# EAGLE design audiostick (EAGLE 9.4.2)
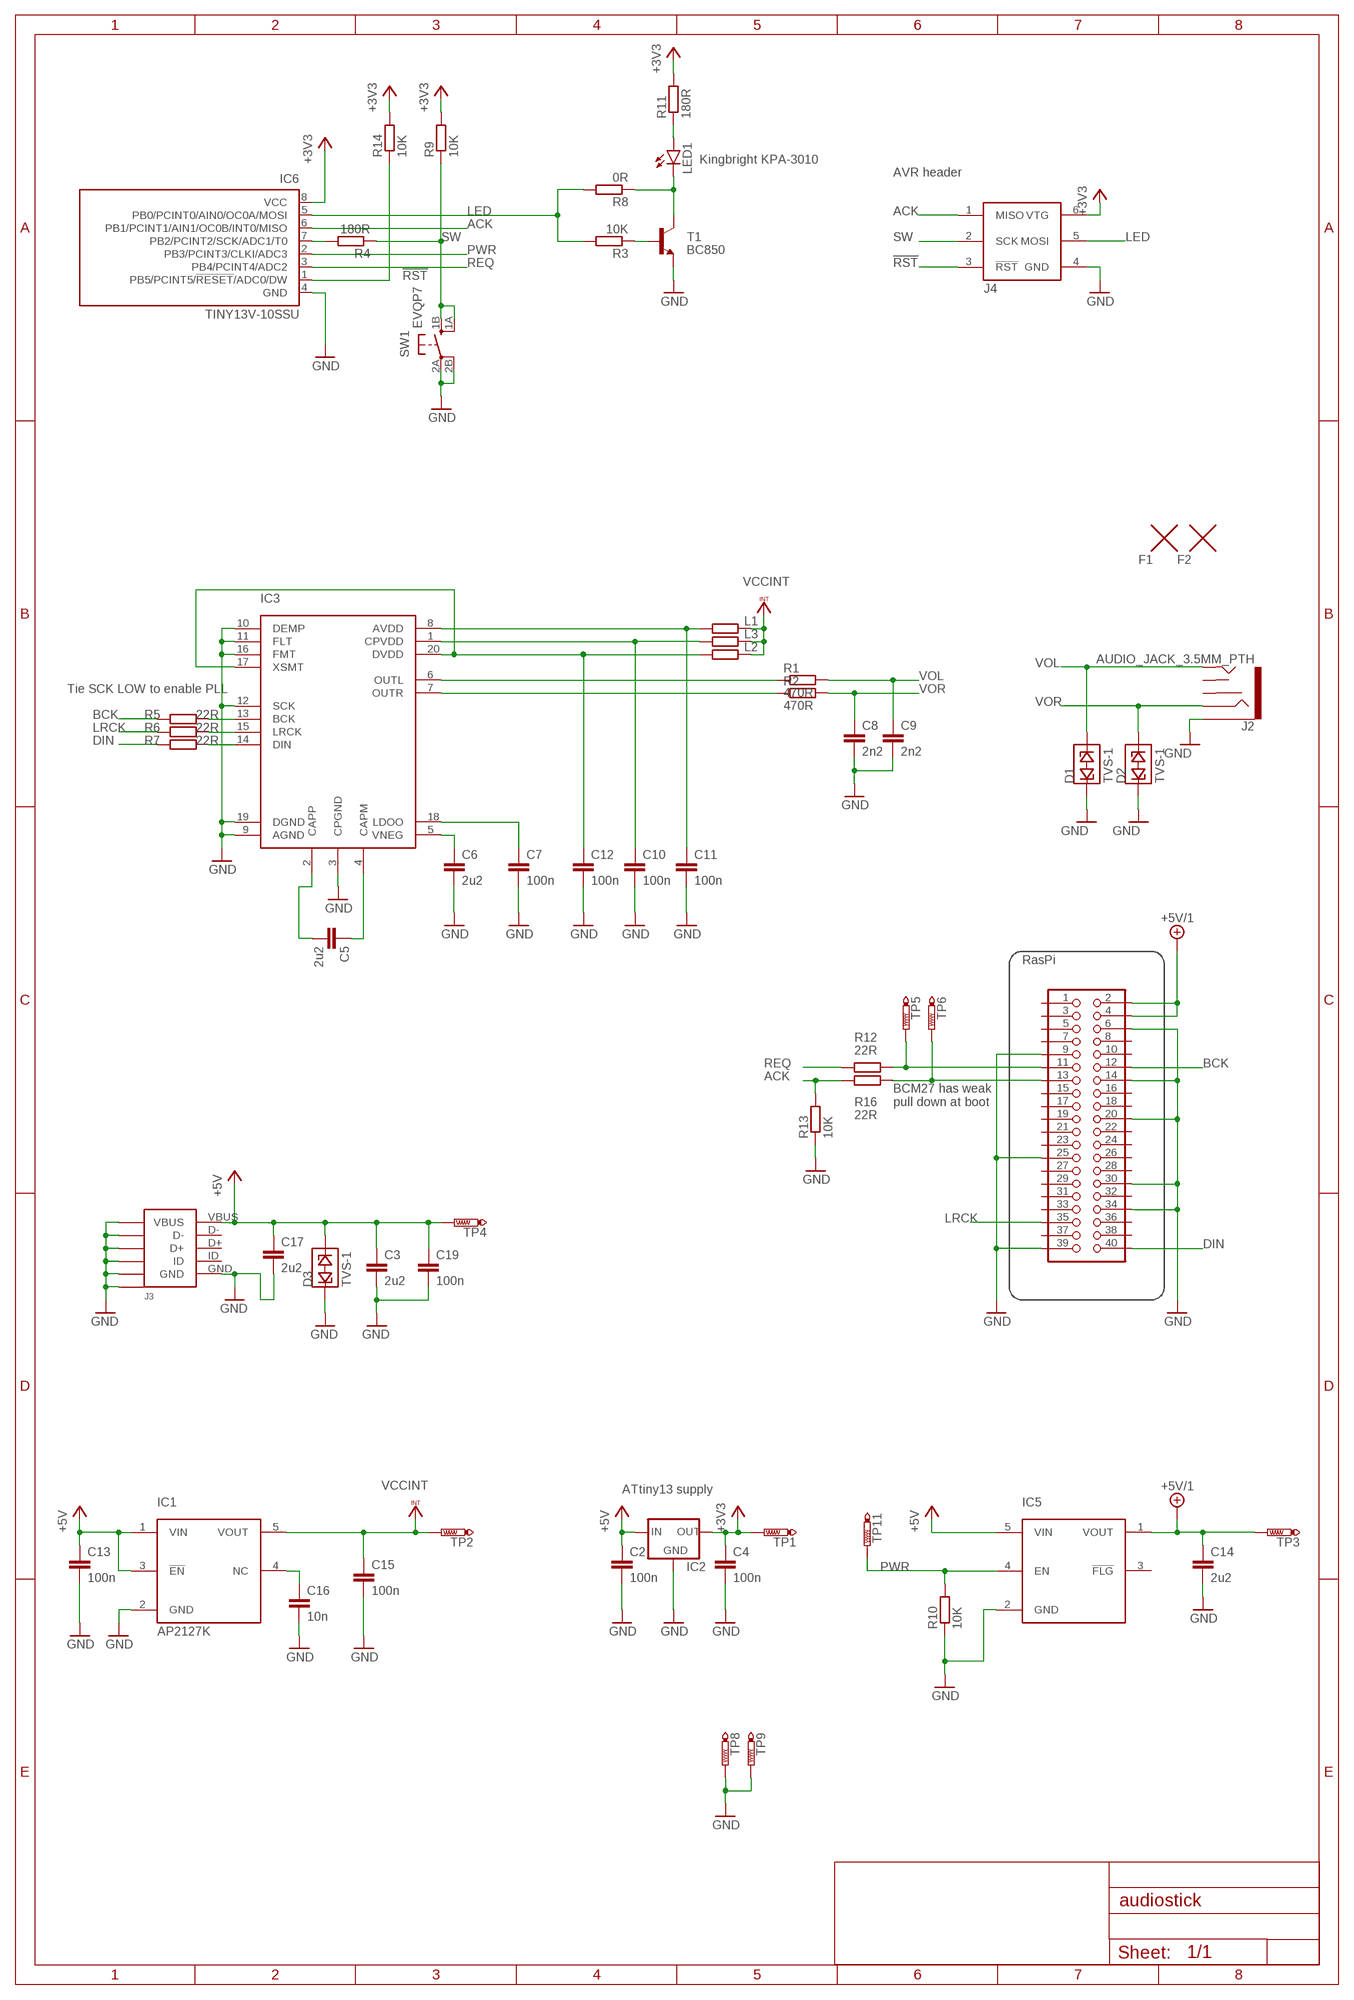
[diagram p0: schematic, sheet 1]

## Parts
C2  100n  C-EUC0603  [C0603]
C3  2u2  C-EUC0603  [C0603]
C4  100n  C-EUC0603  [C0603]
C5  2u2  C-EUC0603  [C0603]
C6  2u2  C-EUC0603  [C0603]
C7  100n  C-EUC0603  [C0603]
C8  2n2  C-EUC0603  [C0603]
C9  2n2  C-EUC0603  [C0603]
C10  100n  C-EUC0603  [C0603]
C11  100n  C-EUC0603  [C0603]
C12  100n  C-EUC0603  [C0603]
C13  100n  C-EUC0603  [C0603]
C14  2u2  C-EUC0603  [C0603]
C15  100n  C-EUC0603  [C0603]
C16  10n  C-EUC0603  [C0603]
C17  2u2  C-EUC0603  [C0603]
C19  100n  C-EUC0603  [C0603]
D1  TVS-1  [R0603]
D2  TVS-1  [R0603]
D3  TVS-1  [R0603]
F1  FIDUCIALC2  [CIRCLE-1MM-3R]
F2  FIDUCIALC2  [CIRCLE-1MM-3R]
IC1  AP2127K  [GHI_SOT23-5]
IC2  MCP1700TT  [SOT-23]
IC3  PCM5102ASW  [TSSOP20]
IC5  AP22804W5  [GHI_SOT23-5]
IC6  TINY13V-10SSU  [8S1]
J2  AUDIO_JACK_3.5MM_PTH  [AUDIO-JACK]
J3  USB-B  [1050170001]
J4  AVRISP  [2X3-1.27]
L1  F  R-EU_R0603  [R0603]
L2  F  R-EU_R0603  [R0603]
L3  F  R-EU_R0603  [R0603]
LED1  LEDLED  [KPA-3010]
R1  470R  R-EU_R0603  [R0603]
R2  470R  R-EU_R0603  [R0603]
R3  10K  R-EU_R0603  [R0603]
R4  180R  R-EU_R0603  [R0603]
R5  22R  R-EU_R0603  [R0603]
R6  22R  R-EU_R0603  [R0603]
R7  22R  R-EU_R0603  [R0603]
R8  0R  R-EU_R0603  [R0603]
R9  10K  R-EU_R0603  [R0603]
R10  10K  R-EU_R0603  [R0603]
R11  180R  R-EU_R0603  [R0603]
R12  22R  R-EU_R0603  [R0603]
R13  10K  R-EU_R0603  [R0603]
R14  10K  R-EU_R0603  [R0603]
R16  22R  R-EU_R0603  [R0603]
SW1  EVQP7  [EVQP7L]
T1  BC850  [SOT23]
TP1  PTR1PAD1-13  [P1-13]
TP2  PTR1PAD1-13  [P1-13]
TP3  PTR1PAD1-13  [P1-13]
TP4  PTR1PAD1-13  [P1-13]
TP5  PTR1PAD1-13  [P1-13]
TP6  PTR1PAD1-13  [P1-13]
TP8  PTR1PAD1-13  [P1-13]
TP9  PTR1PAD1-13  [P1-13]
TP11  PTR1PAD1-13  [P1-13]
U$1  RASPIZERO  [RASPIZERO]

## Nets
!RST: IC6.1(PB5/PCINT5/!RESET!/ADC0/DW) J4.3(!RST) R14.1
+3V3: C4.1 IC2.2(OUT) IC6.8(VCC) J4.6(VTG) R9.2 R11.2 R14.2 TP1.TP
+5V: C2.1 C3.1 C13.1 C17.1 C19.1 D3.2 IC1.1(VIN) IC1.3(!EN) IC2.3(IN) IC5.5(VIN) J3.VBUS TP4.TP
+5V/1: C14.1 IC5.1(VOUT) TP3.TP U$1.2(5V) U$1.4(5V)
ACK: IC6.6(PB1/PCINT1/AIN1/OC0B/INT0/MISO) J4.1(MISO) R13.2 R16.1
ACK_IN: R16.2 TP6.TP U$1.13
BCK: R5.1 U$1.12
DIN: R7.1 U$1.40
GND: C2.2 C3.2 C4.2 C6.2 C7.2 C8.2 C9.2 C10.2 C11.2 C12.2 C13.2 C14.2 C15.2 C16.2 C17.2 C19.2 D1.1 D2.1 D3.1 IC1.2(GND) IC2.1(GND) IC3.3(CPGND) IC3.9(AGND) IC3.10(DEMP) IC3.11(FLT) IC3.12(SCK) IC3.16(FMT) IC3.19(DGND) IC5.2(GND) IC6.4(GND) J2.SLEEVE J3.GND J3.P$1(SH1*4) J3.P$2(SH1*1) J3.P$3(SH1*2) J3.P$4(SH1*3) J3.P$10(SH1*5) J3.P$11(SH1*6) J4.4(GND) R10.1 R13.1 SW1.2A(P) SW1.2B(P1) T1.2(E) TP8.TP TP9.TP U$1.6(GND) U$1.9(GND) U$1.14(GND) U$1.20(GND) U$1.25(GND) U$1.30(GND) U$1.34(GND) U$1.39(GND)
LED: IC6.5(PB0/PCINT0/AIN0/OC0A/MOSI) J4.5(MOSI) R3.2 R8.2
LRCK: R6.1 U$1.35
N$1: C5.1 IC3.4(CAPM)
N$2: C5.2 IC3.2(CAPP)
N$3: C6.1 IC3.5(VNEG)
N$4: C7.1 IC3.18(LDOO)
N$5: IC3.6(OUTL) R1.1
N$6: R3.1 T1.1(B)
N$7: C11.1 IC3.8(AVDD) L1.1
N$8: IC3.7(OUTR) R2.1
N$9: IC3.13(BCK) R5.2
N$10: IC3.15(LRCK) R6.2
N$11: IC3.14(DIN) R7.2
N$12: C12.1 IC3.17(XSMT) IC3.20(DVDD) L2.1
N$14: C10.1 IC3.1(CPVDD) L3.1
N$15: LED1.C R8.1 T1.3(C)
N$16: C16.1 IC1.4(NC)
N$17: LED1.A R11.1
N$18: IC6.7(PB2/PCINT2/SCK/ADC1/T0) R4.2
PWR: IC5.4(EN) IC6.2(PB3/PCINT3/CLKI/ADC3) R10.2 TP11.TP
REQ: IC6.3(PB4/PCINT4/ADC2) R12.1
S_REQ': R12.2 TP5.TP U$1.11
SW: J4.2(SCK) R4.1 R9.1 SW1.1A(S1) SW1.1B(S)
VCCINT: C15.1 IC1.5(VOUT) L1.2 L2.2 L3.2 TP2.TP
VOL: C9.1 D1.2 J2.TIP R1.2
VOR: C8.1 D2.2 J2.RING R2.2
Unconnected: IC5.3(!FLG) J2.RSH J2.TSH J3.D+ J3.D- J3.ID U$1.1(3V3) U$1.3 U$1.5 U$1.7 U$1.8 U$1.10 U$1.15 U$1.16 U$1.17(3V3) U$1.18 U$1.19 U$1.21 U$1.22 U$1.23 U$1.24 U$1.26 U$1.27 U$1.28 U$1.29 U$1.31 U$1.32 U$1.33 U$1.36 U$1.37 U$1.38

## Notes on the sheet
- Kingbright KPA-3010
- AVR header
- Tie SCK LOW to enable PLL
- BCM27 has weak
  pull down at boot
- ATtiny13 supply

## Library data of the parts
C2-C17 C19 = rcl:C-EU: CAPACITOR, European symbol; SPICEPREFIX: C
D1-D3 = AudioStick:TVS-1
F1 F2 = fiducial:FIDUCIAL
IC1 = AudioStick:AP2127: Diodes Inc AP2127 LDO regulator
IC2 = AWJLEagleLib:MCP1700: Microchip MCP1700 positive regulator
IC3 = AudioStick:PCM5102A: Texas Instruments PCM5102A DAC
IC5 = AudioStick:AP22804: Diodes Incorporated AP228x4 inrush current limiter IC
IC6 = atmel:TINY13: 8-bit AVR Microcontroller with 1K Bytes In-System Programmable Flash Source: http://www.atmel.com/dyn/resources/prod_documents/2535S.pdf; MPN: ATTINY13V-10SSU; OC_FARNELL: 1455135; OC_NEWARK: 58M3773
J2 = SparkFun-Connectors:AUDIO_JACK_3.5MM: Audio Jack 3.5mm variants of PTH and SMT stereo audio jack with bypass switches. SparkFun Products: SparkFun SparkPunk Sound Kit <[https://www.sparkfun.com/products/11177]> - PTH MP3 Trigger <https://www.sparkfun.com/products/13720> -3.5mm SMD SparkFun PicoBoard <https://www.sparkfun.com/products/11888>- 2.5mm SMD; PROD_ID: CONN-08774; SF_ID: PRT-08032
J3 = AWJLEagleLib:USB-B: USB B (2.0) connector
J4 = AudioStick:AVRISP: Atmel AVR 6pin ISP header
L1-L3 R1-R14 R16 = rcl:R-EU_: RESISTOR, European symbol; SPICEPREFIX: R
LED1 = AudioStick:LED
SW1 = AudioStick:EVQP7: Panasonic EVQP7L push switch.
T1 = transistor:BC850: NPN TRANSISTOR
TP1-TP6 TP8 TP9 TP11 = testpad:PTR1: TEST PIN
U$1 = AWJLEagleLib:RASPI

## Board
AudioStick v2
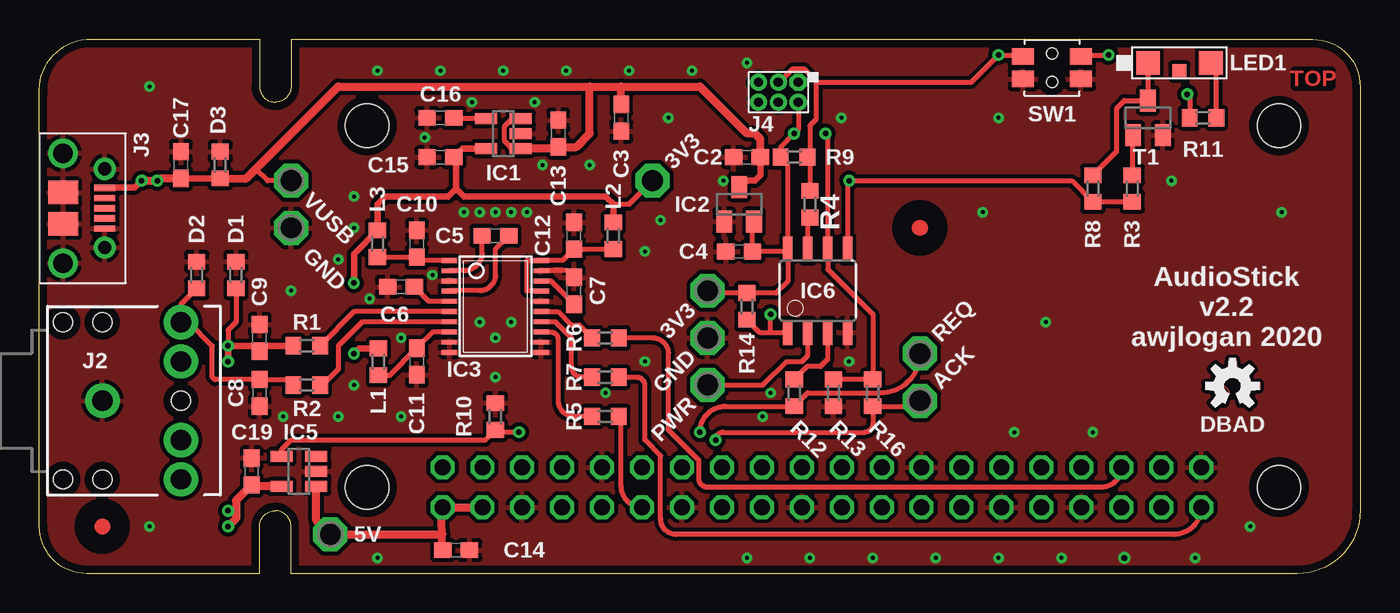
[diagram p1: board, top side]
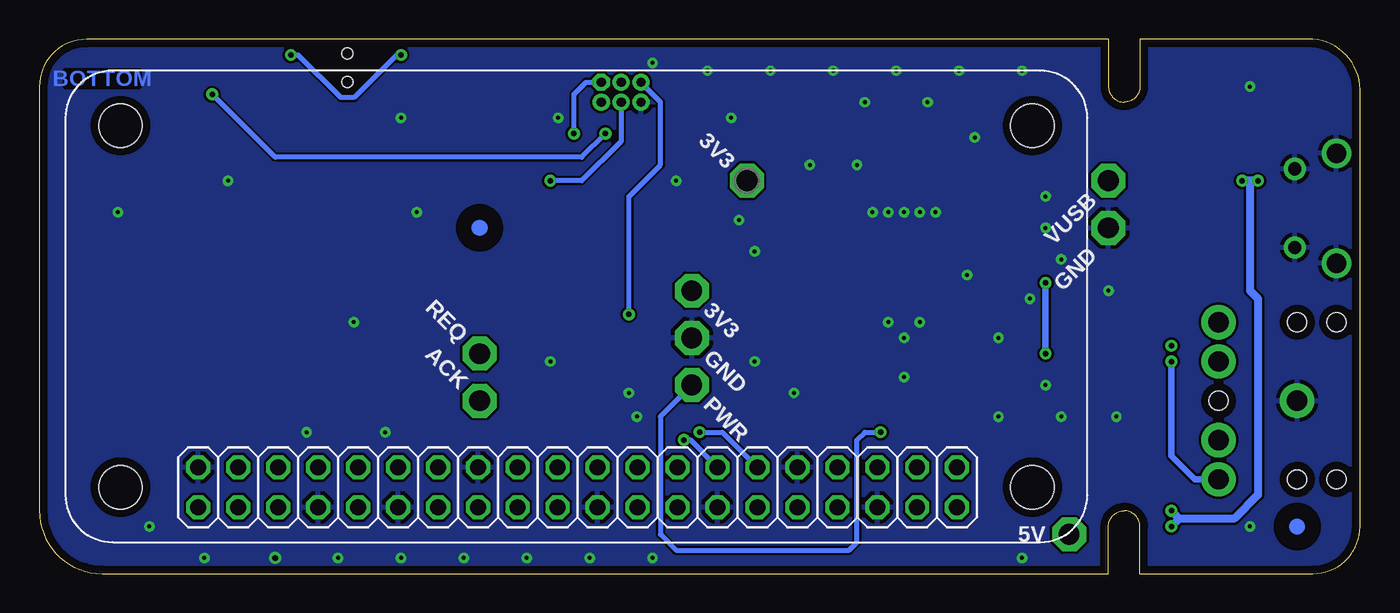
[diagram p2: board, bottom side, seen from below]

Size 84.01 x 34 mm. Coordinates in mm from the lower left corner, seen from the top.
Outline: 0.01,3 0.01,30.5 arc-90 3.01,34 14.01,34 14.01,31 arc90 15.01,30 arc90 16.01,31 16.01,34 81.01,34 arc-90 84.01,31 84.01,4 arc-90 80.01,0 16.01,0 16.01,3 arc90 15.01,4 arc90 14.01,3 14.01,0 3.01,0 arc-90 0.01,3
Copper layers (1*16): Top 0.035mm / dielectric 1.5mm / Bottom 0.035mm
Design rules "default *": minimum track width 6mil, minimum drill 10mil, track to track 6mil, track to pad 6mil, pad to pad 6mil, via to via 6mil, smd to smd 6mil, copper to edge 20mil, drill to drill 6mil, minimum pad ring 10mil, minimum via ring 8mil, stop-mask expansion 4mil, vias tented up to drill 0mil, thermal gap 10mil

### Footprints (pad centres in the part's own frame; a part is rotated, then mirrored left to right if it is on the bottom)
C0603 = smd 1.1 x 1: 1 -0.85,0; 2 0.85,0
R0603 = smd 1 x 1.1: 1 -0.85,0; 2 0.85,0
GHI_SOT23-5 = smd 0.7 x 1.4: 1 0.95,1.1; 2 0,1.1; 3 -0.95,1.1; 4 -0.95,-1.1; 5 0.95,-1.1
SOT-23 = smd 1 x 1.4: 1 -0.95,-1.1; 2 0.95,-1.1; 3 0,1.1
TSSOP20 = smd 0.305 x 0.991: 1 -2.925,-2.918; 2 -2.275,-2.918; 3 -1.625,-2.918; 4 -0.975,-2.918; 5 -0.325,-2.918; 6 0.325,-2.918; 7 0.975,-2.918; 8 1.625,-2.918; 9 2.275,-2.918; 10 2.925,-2.918; 11 2.925,2.918; 12 2.275,2.918; 13 1.625,2.918; 14 0.975,2.918; 15 0.325,2.918; 16 -0.325,2.918; 17 -0.975,2.918; 18 -1.625,2.918; 19 -2.275,2.918; 20 -2.925,2.918
8S1 = smd 0.6 x 1.6: 1 -1.905,-2.654; 2 -0.645,-2.654; 3 0.625,-2.654; 4 1.895,-2.654; 5 1.905,2.654; 6 0.635,2.654; 7 -0.635,2.654; 8 -1.905,2.654
AUDIO-JACK = drill 1.3 pad 2.184: RING 5,5; RSH 5,2.5; SLEEVE 0,0; TIP 5,-5; TSH 5,-2.5 | hole 1.2: 0,5; -2.5,5; -2.5,-5; 0,-5; 5,0
1050170001 = smd 0.4 x 1.35: D+ 3.75,4.15; D- 3.1,4.15; GND 5.05,4.15; ID 4.4,4.15; VBUS 2.45,4.15 | smd 1.5 x 1.9: P$1 2.75,1.5; P$2 4.75,1.5 | drill 0.85 pad 1.422: P$3 1.25,4.15; P$4 6.25,4.15 | drill 1.25: P$10 0.25,1.5; P$11 7.25,1.5
2X3-1.27 = drill 0.6 octagon: 1 1.27,1.27 | drill 0.6: 2 0,1.27; 3 -1.27,1.27; 4 -1.27,0; 5 0,0; 6 1.27,0
KPA-3010 = smd 1.5 x 1.5: A 2,0; C -2,0 | smd 0.9 x 0.9: MECH 0,-0.55
EVQP7L = smd 1.4 x 1.05: 1A -1.85,0.725; 1B 1.85,0.725; 2A -1.85,-0.725; 2B 1.85,-0.725 | hole 0.7: 0,0.9; 0,-0.9
SOT23 = smd 1 x 1.4: 1 -0.95,-1.1; 2 0.95,-1.1; 3 0,1.1
P1-13 = drill 1.321 pad 2.159 octagon: TP 0,0
RASPIZERO = drill 1.016 octagon: 1 8.288,25.23; 2 8.288,27.77; 3 10.828,25.23; 4 10.828,27.77; 5 13.368,25.23; 6 13.368,27.77; 7 15.908,25.23; 8 15.908,27.77; 9 18.448,25.23; 10 18.448,27.77; 11 20.988,25.23; 12 20.988,27.77; 13 23.528,25.23; 14 23.528,27.77; 15 26.068,25.23; 16 26.068,27.77; 17 28.608,25.23; 18 28.608,27.77; 19 31.148,25.23; 20 31.148,27.77; 21 33.688,25.23; 22 33.688,27.77; 23 36.228,25.23; 24 36.228,27.77; 25 38.768,25.23; 26 38.768,27.77; 27 41.308,25.23; 28 41.308,27.77; 29 43.848,25.23; 30 43.848,27.77; 31 46.388,25.23; 32 46.388,27.77; 33 48.928,25.23; 34 48.928,27.77; 35 51.468,25.23; 36 51.468,27.77; 37 54.008,25.23; 38 54.008,27.77; 39 56.548,25.23; 40 56.548,27.77 | hole 2.75: 3.5,26.5; 61.5,26.5; 3.5,3.5; 61.5,3.5

### Placement (x,y rotation side)
C2  45.01,26.5 180 top
C3  37.01,29 270 top
C4  44.51,20.5 180 top
C5  29.01,21.5 180 top
C6  23.01,18.25 180 top
C7  34.01,18 90 top
C8  14.01,11.5 270 top
C9  14.01,15 90 top
C10  24.01,21 90 top
C11  24.01,13.5 270 top
C12  34.01,21.5 90 top
C13  33.01,28 90 top
C14  26.51,1.5 0 top
C15  25.51,26.5 180 top
C16  25.51,29 180 top
C17  9.01,26 90 top
C19  13.51,6.5 90 top
D1  12.51,19 270 top
D2  10.01,19 270 top
D3  11.51,26 270 top
F1  4.01,3 0 top
F2  56.01,22 0 top
IC1  29.51,28 270 top
IC2  44.51,23.5 0 top
IC3  29.01,17 270 top
IC5  16.51,6.5 270 top
IC6  49.51,18 0 top
J2  4.01,11 0 top
J3  0.01,27 270 top
J4  47.01,30 0 top
L1  21.57,13.47 90 top
L2  36.51,21.5 90 top
L3  21.51,21 90 top
LED1  72.51,32.5 0 top
R1  17.01,14.5 180 top
R2  17.01,12 180 top
R3  69.51,24.5 270 top
R4  49.01,23.5 270 top
R5  36.01,10 180 top
R6  36.01,15 180 top
R7  36.01,12.5 180 top
R8  67.01,24.5 270 top
R9  48.01,26.5 180 top
R10  29.01,10 270 top
R11  74.01,29 180 top
R12  48.01,11.5 270 top
R13  50.51,11.5 90 top
R14  45.01,17 90 top
R16  53.01,11.5 270 top
SW1  64.41,32.2 0 top
T1  70.51,29 0 top
TP1  42.51,18 0 top
TP2  39.01,25 0 bottom
TP3  18.51,2.5 0 top
TP4  16.01,25 0 top
TP5  56.01,14 0 top
TP6  56.01,11 0 top
TP8  16.01,22 0 top
TP9  42.51,15 0 top
TP11  42.51,12 0 top
U$1  17.35,32 180 bottom

### Tracks (layer width: path | path; a pad name or v marks a point on that pad's centre or on a via)
!RST  (via drill 0.35)
  Top 0.305: R14.1 45.81,15.35 46.51,15.35 | 46.51,15.35 IC6.1 | 46.51,15.35 v46.51,16.5
  Bottom 0.305: v46.51,16.5 46.51,24 44.51,26 44.51,30 45.47,30.96 45.74,31.23 J4.3
+3V3  (via drill 0.35)
  Top 0.305: IC6.8 47.6,18.59 46.86,17.85 R14.2 42.66,17.85 TP1.TP | IC6.8 47.6,26.05 R9.2 47.16,27.15 v48.01,28 48.28,28.27 J4.6 | IC2.2 45.36,22.3 C4.1 47.45,20.5 IC6.8 | v73.01,30.5 73.16,30.35 R11.2
  Bottom 0.305: v48.01,28 49.51,26.5 69.01,26.5 v73.01,30.5
+5V  (via drill 0.35)
  Top 0.305: TP4.TP 14.51,25 13.76,25.75 | IC1.1 30.56,27 30.01,27 30.01,27.12 29.6,27.52 29.6,28.48 30.01,28.88 30.54,28.88 IC1.3
  Top 0.406: C2.1 45.86,25.35 45.51,25 44.51,25 IC2.3 | D3.2 C17.1 | J3.VBUS 6.06,24.55 v6.51,25
  Top 0.508: 35.01,31 19.01,31 13.76,25.75 13.16,25.15 D3.2 | 35.01,31 37.01,31 | 37.01,31 42.01,31 45.01,28 45.51,28 45.86,27.65 C2.1 | 35.01,31 35.01,28 34.16,27.15 C13.1 32.91,27.05 IC1.1 | v12.01,4 12.51,4 | 12.51,4 12.51,4.65 C19.1 13.61,5.55 IC5.5 | C3.1 37.01,31 | v6.51,25 v7.51,25 7.66,25.15 C17.1 | 12.51,4 12.51,3.5 v12.01,3
  Bottom 0.508: v6.51,25 7.01,25 | 7.01,25 v7.51,25 | 7.01,25 7.01,18 6.51,17.5 6.51,5 8.01,3.5 11.51,3.5 | 11.51,3.5 v12.01,4 | 11.51,3.5 v12.01,3
+5V/1
  Top 0.508: U$1.4 U$1.2 25.56,4.15 25.62,2.5 | IC5.1 17.61,3.4 TP3.TP 25.62,2.5 | C14.1 25.62,2.5
ACK  (via drill 0.35)
  Top 0.305: v50.01,28 50.14,27.86 IC6.6 50.14,19.36 53.01,16.5 R16.1 R13.2
  Bottom 0.305: v50.01,28 50.01,30.5 49.24,31.27 J4.1
ACK_IN  (via drill 0.35)
  Top 0.305: TP6.TP 55.66,10.65 R16.2 53.01,9.5 arc-90 52.51,9 43.51,9 arc90 v43.01,8.5
  Bottom 0.305: U$1.13 42.61,8.5 v43.01,8.5
BCK
  Top 0.305: R5.1 37.01,9.85 37.01,5.56 arc90 U$1.12
DIN
  Top 0.305: R7.1 38.01,12.5 arc-90 38.51,12 38.51,8.5 39.51,7.5 39.51,3.5 arc90 40.51,2.5 72.17,2.5 arc90 U$1.40
GND  (via drill 0.25, 0.35)
  Top 0.305: C7.2 33.58,19.27 IC3.19
  other vias: 28.01,16 29.01,15 30.01,16 19.01,20 27.01,23 29.01,23 31.01,23 30.01,23 28.01,23 69.01,1 61.01,29 40.01,29 72.01,25 64.01,16 60.01,23 67.01,9 62.01,9 77.01,3 51.01,29 38.51,13.5 73.51,1 46.01,10 16.01,18 15.51,10 19.01,10 7.01,31 79.01,23 7.01,3 51.51,13.5 46.51,11.5 45.01,1 49.01,1 53.01,1 57.01,1 61.01,1 65.01,1 25.01,19 29.01,12.5 36.01,11.5 23.01,10 21.51,1 20.01,12 31.51,30 27.51,30 21.51,32 25.51,32 29.51,32 33.51,32 37.51,32 41.51,32 45.01,32.5 35.01,26 32.01,26 24.51,27.75 20.01,24 20.01,22 21.01,17.5 23.01,15 38.51,20.5 39.51,22.5 43.51,25
  pour Top (isolate 0.254): 0.01,0 0.01,34 84.01,34 84.01,0
  pour Bottom: 0.01,0 0.01,34 84.01,34 84.01,10 83.97,9.96 84.01,9.96 84.01,0
LED  (via drill 0.35)
  Top 0.305: IC6.5 51.41,25.09 v51.51,25 65.66,25 R8.2 R3.2
  Bottom 0.305: v51.51,25 49.51,25 47.01,27.5 J4.5
LRCK
  Top 0.305: R6.1 39.01,15 arc-90 40.01,14 40.01,9.15 41.94,7.21 41.94,6.07 arc90 42.51,5.5 67.55,5.5 arc90 U$1.35
N$1
  Top 0.305: IC3.4 26.12,18 28.01,18 arc90 29.01,19 29.01,20.65 C5.1
N$2
  Top 0.305: IC3.2 27.01,19.27 arc90 28.16,20.43 C5.2
N$3
  Top 0.305: C6.1 24.78,17.32 IC3.5
N$4
  Top 0.305: IC3.18 32.53,18.62 C7.1
N$5
  Top 0.305: IC3.6 20.03,16.68 R1.1
N$6
  Top 0.305: T1.1 69.51,27.85 R3.1
N$7
  Top 0.305: L1.1 22.28,12.62 C11.1 25.03,15.38 IC3.8
N$8
  Top 0.305: R2.1 18.01,12 19.01,13 19.01,14.5 20.53,16.02 IC3.7
N$9
  Top 0.305: R5.2 34.01,10 arc-90 33.01,11 33.01,14.89 arc90 32.52,15.38 IC3.13
N$10
  Top 0.305: IC3.15 32.98,16.68 33.83,15.82 34.33,15.82 R6.2
N$11
  Top 0.305: 32.51,16.02 32.83,16.02 33.85,15 33.85,14.5 33.85,13.15 arc90 34.51,12.5 R7.2 | 32.51,16.02 IC3.14 | 32.51,16.02
N$12
  Top 0.305: IC3.17 31.01,17.98 31.01,19.93 IC3.20 33.28,19.93 C12.1 L2.1
N$13
  Top 0.01: 76.34,10.83 arc10 76.52,10.92 76.96,10.56 77.26,10.86 76.9,11.3 arc19 77.06,11.67 77.62,11.73 77.62,12.15 77.06,12.21 arc-19 76.9,12.58 77.26,13.02 76.96,13.32 76.52,12.96 arc-19 76.16,13.11 76.1,13.68 75.67,13.68 75.61,13.11 arc-19 75.25,12.96 74.81,13.32 74.51,13.02 74.86,12.58 arc-19 74.71,12.21 74.15,12.15 74.15,11.73 74.71,11.67 arc19 74.86,11.3 74.51,10.86 74.81,10.56 75.25,10.92 arc10 75.42,10.83 75.68,11.44 arc67 75.34,11.94 arc-247 76.09,11.44 76.34,10.83
N$14
  Top 0.305: IC3.1 24.23,19.93 C10.1 L3.1
N$15
  Top 0.305: LED1.C T1.3 69.01,30.1 68.51,29.6 68.51,26.85 R8.1
N$16
  Top 0.305: IC1.4 26.41,28.95 C16.1
N$17
  Top 0.305: R11.1 74.86,32.15 arc90 LED1.A
N$18
  Top 0.305: IC6.7 48.87,22.52 R4.2
PWR  (via drill 0.35)
  Top 0.305: IC6.2 48.86,13.86 48.51,13.5 47.51,13.5 46.01,12 TP11.TP | v30.51,9 29.16,9 R10.2 28.36,8.5 16.01,8.5 15.41,7.9 IC5.4
  Bottom 0.305: TP11.TP 44.51,10 44.51,2.5 43.51,1.5 32.51,1.5 32.01,2 32.01,8.5 31.51,9 v30.51,9
REQ
  Top 0.305: R12.1 48.83,13.18 49.68,13.18 50.13,13.62 IC6.3
S_REQ'  (via drill 0.35)
  Top 0.305: TP5.TP arc-90 53.51,11.5 48.86,11.5 R12.2 43.66,10.65 arc90 v42.01,9
  Bottom 0.305: U$1.11 40.57,9 v42.01,9
SW  (via drill 0.35)
  Top 0.305: R4.1 49.01,26.35 R9.1 49.01,26.65 49.01,28.5 49.39,28.88 49.39,31.38 | SW1.1A 62.48,33 v61.01,33 59.28,31.27 49.49,31.27 49.39,31.38 | SW1.1B 66.33,33 v68.01,33 | J4.2 47.06,31.27 47.92,32.13 48.64,32.13 49.39,31.38
  Bottom 0.305: v61.01,33 61.27,33 63.99,30.29 64.83,30.29 67.54,33 v68.01,33
VCCINT  (via drill 0.35)
  Top 0.305: 36.51,23.5 37.51,23.5 TP2.TP
  Top 0.406: L1.2 20.33,14.32 v20.01,14 | v20.01,18.5 20.01,20.35 L3.2 21.51,23.5 22.01,24 26.01,24 26.51,24.5 | 26.51,24.5 26.51,26.35 C15.1 26.43,26.57 26.91,27.05 IC1.5 | 26.51,24.5 27.01,24 36.01,24 36.51,23.5 L2.2
  Bottom 0.406: v20.01,18.5 v20.01,14
VOL  (via drill 0.35)
  Top 0.305: 14.36,14.5 C9.1 | D1.2 12.51,16 12.01,15.5 v12.01,14.5
  Top 0.406: R1.2 14.36,14.5 | C9.1 13.66,14.5 v12.01,14.5 v12.01,13.5
  Bottom 0.406: J2.TIP 10.51,6 12.01,7.5 v12.01,13.5
VOR
  Top 0.305: R2.2 15.81,12.35 C8.1 11.16,12.35 11.01,12.5 11.01,14.5 9.51,16 J2.RING 9.01,17.15 D2.2

### Text on the board
Top: TOP
Bottom: BOTTOM
tNames: 3V3 | VUSB | GND | 3V3 | AudioStick / v2.2 / awjlogan 2020 | REQ | GND | ACK | PWR | DBAD | 5V
bNames: 3V3 | VUSB | GND | 3V3 | REQ | GND | ACK | PWR | 5V